# Altium schematic sheet Sheet_bug.SchDoc
size B
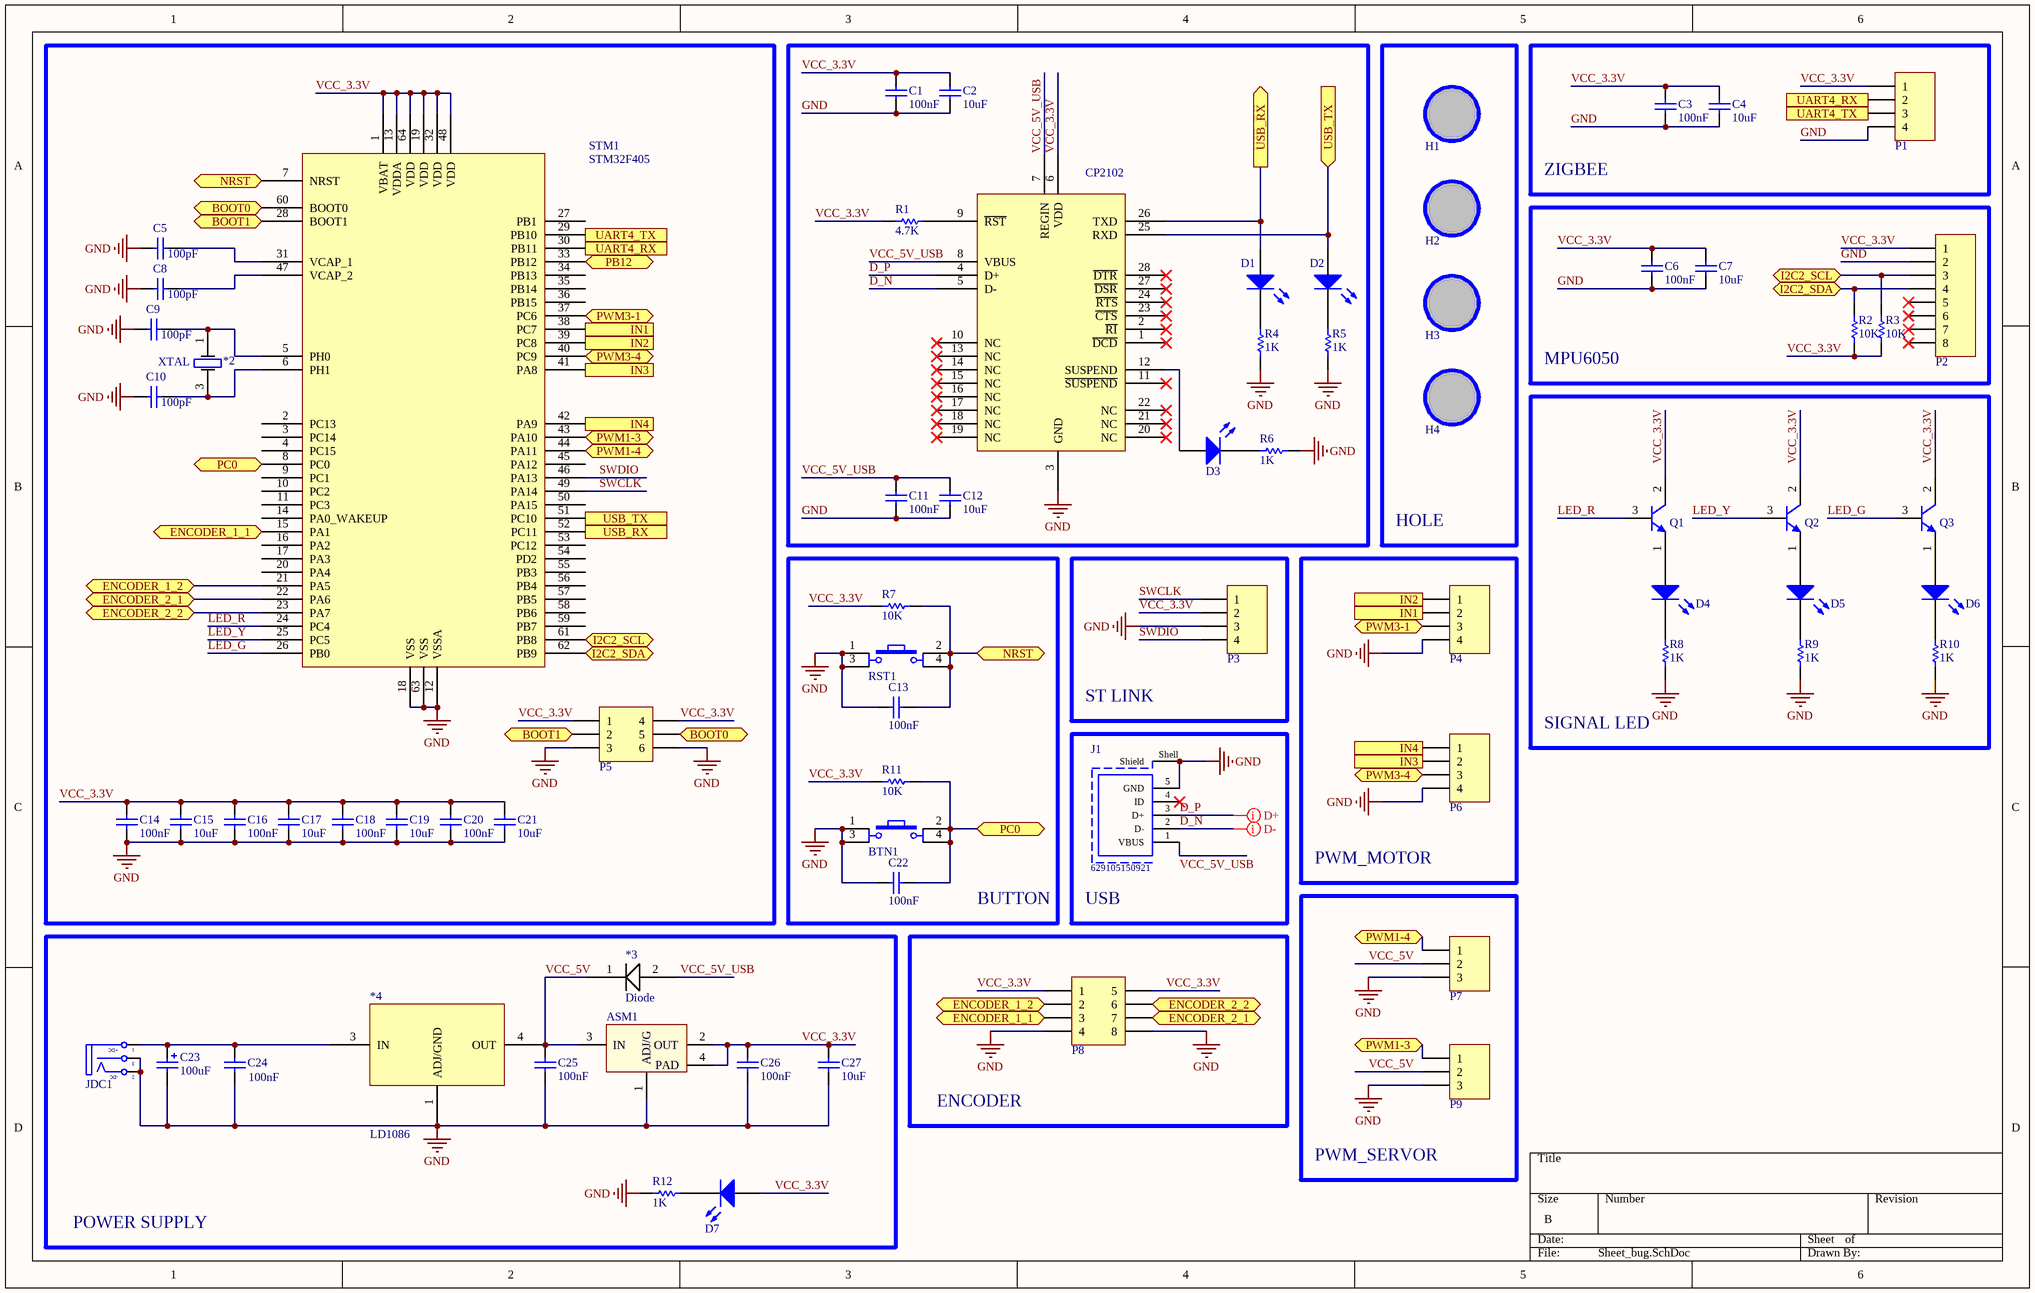
[diagram p0: Sheet_bug.SchDoc]

## Parts
*1  CP2102  [QFN50P500X500X90_HS-29N]
*2  XTAL  [XTAL SMD 4PIN]
*3  Diode  [DIODE SMA (DO-214AC)]
*4  LD1086  [DPAK228P972X230-3N]
ASM1  LM1117  [SOT223-4N]  (value not drawn)
BTN1  SW  [Tact SW 4 pin]  (value not drawn)
C1  value 100nF  [CAP-SM-0603]  (hidden comment: Cap Non-Pol SMD)
C2  value 10uF  [CAP-SM-0603]  (hidden comment: Cap Non-Pol SMD)
C3  value 100nF  [CAP-SM-0603]  (hidden comment: Cap Non-Pol SMD)
C4  value 10uF  [CAP-SM-0603]  (hidden comment: Cap Non-Pol SMD)
C5  value 100pF  [CAP-SM-0603]  (hidden comment: Cap Non-Pol SMD)
C6  value 100nF  [CAP-SM-0603]  (hidden comment: Cap Non-Pol SMD)
C7  value 10uF  [CAP-SM-0603]  (hidden comment: Cap Non-Pol SMD)
C8  value 100pF  [CAP-SM-0603]  (hidden comment: Cap Non-Pol SMD)
C9  value 100pF  [CAP-SM-0603]  (hidden comment: Cap Non-Pol SMD)
C10  value 100pF  [CAP-SM-0603]  (hidden comment: Cap Non-Pol SMD)
C11  value 100nF  [CAP-SM-0603]  (hidden comment: Cap Non-Pol SMD)
C12  value 10uF  [CAP-SM-0603]  (hidden comment: Cap Non-Pol SMD)
C13  value 100nF  [CAP-SM-0603]  (hidden comment: Cap Non-Pol SMD)
C14  value 100nF  [CAP-SM-0603]  (hidden comment: Cap Non-Pol SMD)
C15  value 10uF  [CAP-SM-0603]  (hidden comment: Cap Non-Pol SMD)
C16  value 100nF  [CAP-SM-0603]  (hidden comment: Cap Non-Pol SMD)
C17  value 10uF  [CAP-SM-0603]  (hidden comment: Cap Non-Pol SMD)
C18  value 100nF  [CAP-SM-0603]  (hidden comment: Cap Non-Pol SMD)
C19  value 10uF  [CAP-SM-0603]  (hidden comment: Cap Non-Pol SMD)
C20  value 100nF  [CAP-SM-0603]  (hidden comment: Cap Non-Pol SMD)
C21  value 10uF  [CAP-SM-0603]  (hidden comment: Cap Non-Pol SMD)
C22  value 100nF  [CAP-SM-0603]  (hidden comment: Cap Non-Pol SMD)
C23  value 100uF  [CAP ALU SIZE B]  (hidden comment: Cap Pol SMD)
C24  value 100nF  [CAP-SM-0805]  (hidden comment: Cap Non-Pol SMD)
C25  value 100nF  [CAP-SM-0805]  (hidden comment: Cap Non-Pol SMD)
C26  value 100nF  [CAP-SM-0805]  (hidden comment: Cap Non-Pol SMD)
C27  value 10uF  [CAP-SM-0805]  (hidden comment: Cap Non-Pol SMD)
D1  LED SMD  [LED_0603_Blue]  (value not drawn)
D2  LED SMD  [LED_0603_Blue]  (value not drawn)
D3  LED SMD  [LED_0603_Blue]  (value not drawn)
D4  LED SMD  [LED_0603_Blue]  (value not drawn)
D5  LED SMD  [LED_0603_Blue]  (value not drawn)
D6  LED SMD  [LED_0603_Blue]  (value not drawn)
D7  LED SMD  [LED_0603_Blue]  (value not drawn)
H1  Hole  [LO KHOAN 3MM]  (value not drawn)
H2  Hole  [LO KHOAN 3MM]  (value not drawn)
H3  Hole  [LO KHOAN 3MM]  (value not drawn)
H4  Hole  [LO KHOAN 3MM]  (value not drawn)
J1  629105150921  [629105150921]
JDC1  Jack DC  [DC-IN]  (value not drawn)
P1  Header 4  [JP4]  (value not drawn)
P2  Header 8  [JP8]  (value not drawn)
P3  Header 4  [JP4]  (value not drawn)
P4  Header 4  [JP4]  (value not drawn)
P5  Header 3X2  [JP3x2]  (value not drawn)
P6  Header 4  [JP4]  (value not drawn)
P7  Header 3  [JP3]  (value not drawn)
P8  Header 4X2  [JP4x2]  (value not drawn)
P9  Header 3  [JP3]  (value not drawn)
Q1  C1815  [SOT23B]  (value not drawn)
Q2  C1815  [SOT23B]  (value not drawn)
Q3  C1815  [SOT23B]  (value not drawn)
R1  value 4.7K  [RES-SM-0603]  (hidden comment: RESISTOR SMD)
R2  value 10K  [RES-SM-0603]  (hidden comment: RESISTOR SMD)
R3  value 10K  [RES-SM-0603]  (hidden comment: RESISTOR SMD)
R4  value 1K  [RES-SM-0603]  (hidden comment: RESISTOR SMD)
R5  value 1K  [RES-SM-0603]  (hidden comment: RESISTOR SMD)
R6  value 1K  [RES-SM-0603]  (hidden comment: RESISTOR SMD)
R7  value 10K  [RES-SM-0603]  (hidden comment: RESISTOR SMD)
R8  value 1K  [RES-SM-0603]  (hidden comment: RESISTOR SMD)
R9  value 1K  [RES-SM-0603]  (hidden comment: RESISTOR SMD)
R10  value 1K  [RES-SM-0603]  (hidden comment: RESISTOR SMD)
R11  value 10K  [RES-SM-0603]  (hidden comment: RESISTOR SMD)
R12  value 1K  [RES-SM-0603]  (hidden comment: RESISTOR SMD)
RST1  SW  [Tact SW 4 pin]  (value not drawn)
STM1  STM32F405  [CQFP50P1150X1150X160-64N]

## Blocks framed on the sheet
HOLE: H1-H4
ZIGBEE: C3 C4 P1
MPU6050: C6 C7 P2 R2 R3
SIGNAL LED: D4-D6 Q1-Q3 R8-R10
BUTTON: BTN1 C13 C22 R7 R11 RST1
ST LINK: P3
PWM_MOTOR: P4 P6
USB: J1
PWM_SERVOR: P7 P9
POWER SUPPLY: *3 *4 ASM1 C23-C27 D7 JDC1 R12
ENCODER: P8

## Ports
BOOT0 (bidir), BOOT1 (bidir), ENCODER_1_1 (bidir), ENCODER_1_2 (bidir), ENCODER_2_1 (bidir), ENCODER_2_2 (bidir), I2C2_SCL (bidir), I2C2_SDA (bidir), IN1 (in), IN1 (out), IN2 (in), IN2 (out), IN3 (in), IN3 (out), IN4 (in), IN4 (out), NRST (bidir), PB12 (bidir), PC0 (bidir), PWM1-3 (bidir), PWM1-4 (bidir), PWM3-1 (bidir), PWM3-4 (bidir), UART4_RX (in), UART4_RX (out), UART4_TX (in), UART4_TX (out), USB_RX (in), USB_RX (out), USB_TX (in), USB_TX (out)

## Nets
GND: *1.3(GND) *4.1(ADJ/GND) ASM1.1(ADJ/G) BTN1.1 BTN1.3 C1.2 C2.2 C3.2 C4.2 C5.1 C6.2 C7.2 C8.1 C9.1 C10.1 C11.2 C12.2 C13.2 C14.2 C15.2 C16.2 C17.2 C18.2 C19.2 C20.2 C21.2 C22.2 C23.2 C24.2 C25.1 C26.2 C27.2 J1.5(GND) J1.Shell(Shield) JDC1.2(TN) JDC1.3(S) P1.4 P2.2 P3.3 P4.4 P5.3 P5.6 P6.4 P7.3 P8.4 P8.8 P9.3 R4.1 R5.1 R6.1 R8.1 R9.1 R10.1 R12.1 RST1.1 RST1.3 STM1.12(VSSA) STM1.18(VSS) STM1.63(VSS)
BOOT0: P5.5 STM1.60(BOOT0) ; port BOOT0
BOOT1: P5.2 STM1.28(BOOT1) ; port BOOT1
D_N: *1.5(D-) J1.2(D-)
D_P: *1.4(D+) J1.3(D+)
ENCODER_1_1: P8.3 STM1.15(PA1) ; port ENCODER_1_1
ENCODER_1_2: P8.2 STM1.21(PA5) ; port ENCODER_1_2
ENCODER_2_1: P8.7 STM1.22(PA6) ; port ENCODER_2_1
ENCODER_2_2: P8.6 STM1.23(PA7) ; port ENCODER_2_2
I2C2_SCL: P2.3 R3.2 STM1.61(PB8) ; port I2C2_SCL
I2C2_SDA: P2.4 R2.2 STM1.62(PB9) ; port I2C2_SDA
IN1: P4.2 STM1.38(PC7) ; port IN1
IN2: P4.1 STM1.39(PC8) ; port IN2
IN3: P6.2 STM1.41(PA8) ; port IN3
IN4: P6.1 STM1.42(PA9) ; port IN4
LED_G: Q3.3(B) STM1.26(PB0)
LED_R: Q1.3(B) STM1.24(PC4)
LED_Y: Q2.3(B) STM1.25(PC5)
NRST: C13.1 R7.2 RST1.2 RST1.4 STM1.7(NRST) ; port NRST
PB12: STM1.33(PB12) ; port PB12
PC0: BTN1.2 BTN1.4 C22.1 R11.2 STM1.8(PC0) ; port PC0
PWM1-3: P9.1 STM1.43(PA10) ; port PWM1-3
PWM1-4: P7.1 STM1.44(PA11) ; port PWM1-4
PWM3-1: P4.3 STM1.37(PC6) ; port PWM3-1
PWM3-4: P6.3 STM1.40(PC9) ; port PWM3-4
SWCLK: P3.1 STM1.49(PA14)
SWDIO: P3.4 STM1.46(PA13)
UART4_RX: P1.2 STM1.30(PB11) ; port UART4_RX
UART4_TX: P1.3 STM1.29(PB10) ; port UART4_TX
USB_RX: *1.26(TXD) D1.1(A) STM1.52(PC11) ; port USB_RX
USB_TX: *1.25(RXD) D2.1(A) STM1.51(PC10) ; port USB_TX
VCC_3.3V: *1.6(VDD) ASM1.2(OUT) ASM1.4(PAD) C1.1 C2.1 C3.1 C4.1 C6.1 C7.1 C14.1 C15.1 C16.1 C17.1 C18.1 C19.1 C20.1 C21.1 C26.1 C27.1 D7.1(A) P1.1 P2.1 P3.2 P5.1 P5.4 P8.1 P8.5 Q1.2(C) Q2.2(C) Q3.2(C) R1.2 R2.1 R3.1 R7.1 R11.1 STM1.1(VBAT) STM1.13(VDDA) STM1.19(VDD) STM1.32(VDD) STM1.48(VDD) STM1.64(VDD)
VCC_5V: *3.1 *4.4(OUT) ASM1.3(IN) C25.2 P7.2 P9.2
VCC_5V_USB: *1.7(REGIN) *1.8(VBUS) *3.2 C11.1 C12.1 J1.1(VBUS)
Net*1_9: *1.9(~{RST}) R1.1
Net*1_12: *1.12(SUSPEND) D3.1(A)
Net*2_1: *2.1 C9.2 STM1.5(PH0)
Net*2_3: *2.3 C10.2 STM1.6(PH1)
Net*4_3: *4.3(IN) C23.1 C24.1 JDC1.1(T)
NetC5_2: C5.2 STM1.31(VCAP_1)
NetC8_2: C8.2 STM1.47(VCAP_2)
NetD1_2: D1.2(K) R4.2
NetD2_2: D2.2(K) R5.2
NetD3_2: D3.2(K) R6.2
NetD4_1: D4.1(A) Q1.1(E)
NetD4_2: D4.2(K) R8.2
NetD5_1: D5.1(A) Q2.1(E)
NetD5_2: D5.2(K) R9.2
NetD6_1: D6.1(A) Q3.1(E)
NetD6_2: D6.2(K) R10.2
NetD7_2: D7.2(K) R12.2

Not connected (* = marked no-connect by the designer): *1 1(~{DCD})* 2(~{RI})* 10(NC)* 11(~{SUSPEND})* 13(NC)* 14(NC)* 15(NC)* 16(NC)* 17(NC)* 18(NC)* 19(NC)* 20(NC)* 21(NC)* 22(NC)* 23(~{CTS})* 24(~{RTS})* 27(~{DSR})* 28(~{DTR})*; H1 1; H2 1; H3 1; H4 1; J1 4(ID)*; P2 5* 6* 7* 8*; STM1 2(PC13) 3(PC14) 4(PC15) 9(PC1) 10(PC2) 11(PC3) 14(PA0_WAKEUP) 16(PA2) 17(PA3) 20(PA4) 27(PB1) 34(PB13) 35(PB14) 36(PB15) 45(PA12) 50(PA15) 53(PC12) 54(PD2) 55(PB3) 56(PB4) 57(PB5) 58(PB6) 59(PB7)

## Layout directives
differential pair: D_N, D_P

## Notes on the sheet
- (in symbol Jack DC) +DC; -DC

## Library data of the parts
ASM1 = LM1117: Available in 1.8V, 2.5V, 2.85V, 3.3V, 5V, and  Adjustable Versions; Value: LM317
BTN1 RST1 = Tact SW - 4Pin: Switch button 4 pin; Value: Button chip 4 pin
C1-C22 C24-C27 = Cap Non-Pol SMD: Capacitor
C23 = Cap Pol SMD: Polarized Capacitor (Radial)
D1-D7 = LED SMD: LED
H1-H4 = Hole: Hole 3mm
J1 = 629105150921: Micro USB 2.0 Type AB Receptacle WR-COM, Horizontal, SMT; Rated Current: 1.8 A; Contact Resistance: 30 mOhm; Working Voltage: 30 VAC; ComponentLink1Description: Manufacturer; ComponentLink1URL: http://www.we-online.de; ComponentLink2Description: Datasheet; ComponentLink2URL: https://katalog.we-online.de/em/datasheet/629105150921.pdf; Part Number: 629105150921; Published Date: September 2018; Publisher: Wurth Elektronik; Orientation: Horizontal; Connector Type: Micro USB 2.0 Type AB; Operating Temperature: -40 to 85 degC; Mounting Technology: SMT; Gender: Receptacle; Packaging: Tape and Reel
JDC1 = Jack DC: Jack DC input; Value: Jac DC
P1 P3 P4 P6 = Header 4: Header, 4-Pin; LatestRevisionDate: 17-Jul-2002; LatestRevisionNote: Re-released for DXP Platform.; Publisher: Altium Limited
P2 = Header 8: Header, 8-Pin; LatestRevisionDate: 17-Jul-2002; LatestRevisionNote: Re-released for DXP Platform.; Publisher: Altium Limited
P5 = Header 3X2: Header, 3-Pin, Dual row; LatestRevisionDate: 17-Jul-2002; LatestRevisionNote: Re-released for DXP Platform.; Publisher: Altium Limited
P7 P9 = Header 3: Header, 3-Pin; LatestRevisionDate: 17-Jul-2002; LatestRevisionNote: Re-released for DXP Platform.; Publisher: Altium Limited
P8 = Header 4X2: Header, 4-Pin, Dual row; LatestRevisionDate: 17-Jul-2002; LatestRevisionNote: Re-released for DXP Platform.; Publisher: Altium Limited
Q1-Q3 = C1815: NPN Bipolar Transistor
R1-R12 = RESISTOR SMD: Resistor